# Altium project PULPino_Board.PrjPcb
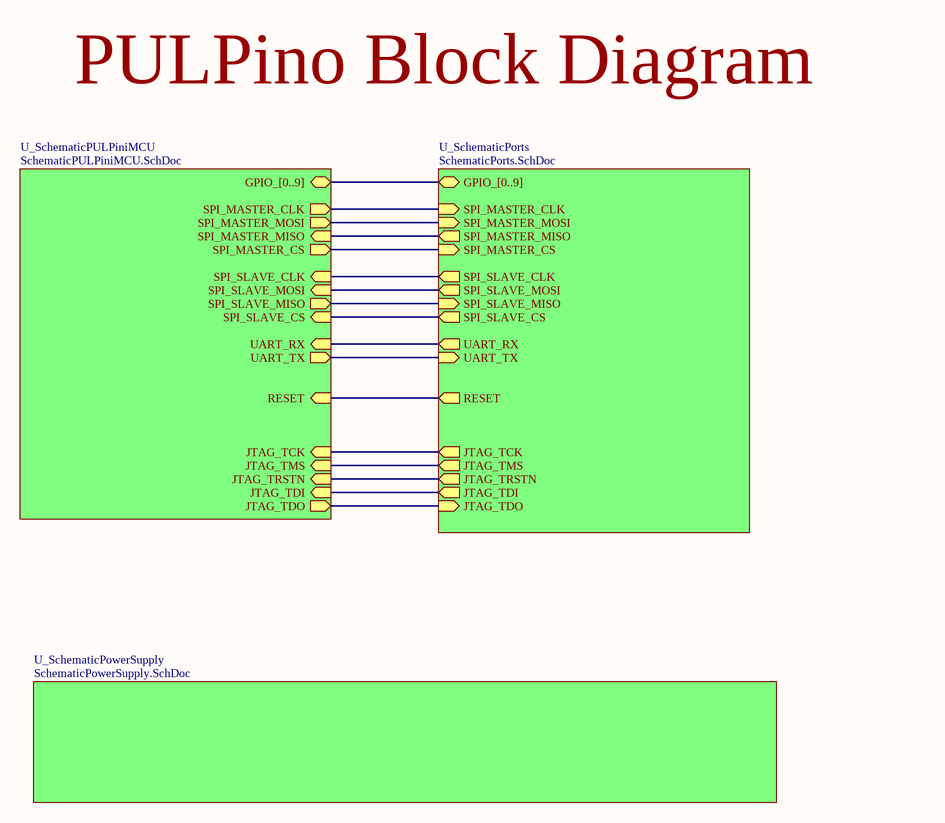
[diagram p0: TopSheet.SchDoc]
4 sheets, 36 parts. Net scope: hierarchical (ports join the sheet entries above them; power ports are global).
Board file: PULpino.PcbDoc
Sheets:
  TopSheet.SchDoc
    U_SchematicPorts = SchematicPorts.SchDoc
    U_SchematicPowerSupply = SchematicPowerSupply.SchDoc
    U_SchematicPULPiniMCU = SchematicPULPiniMCU.SchDoc

## Sheet TopSheet.SchDoc
size A4; DocumentNumber: 1; SheetNumber: 1; SheetTotal: 4

### Sub-sheets
U_SchematicPorts = SchematicPorts.SchDoc: JTAG_TCK (out), JTAG_TRSTN (out), JTAG_TMS (out), JTAG_TDI (out), JTAG_TDO (in), UART_TX (in), UART_RX (out), SPI_MASTER_CS (in), SPI_MASTER_CLK (in), SPI_MASTER_MISO (out), SPI_MASTER_MOSI (in), SPI_SLAVE_CLK (out), SPI_SLAVE_CS (out), SPI_SLAVE_MISO (in), SPI_SLAVE_MOSI (out), GPIO_[0..9] (bidir), RESET (out)
U_SchematicPowerSupply = SchematicPowerSupply.SchDoc: no entries
U_SchematicPULPiniMCU = SchematicPULPiniMCU.SchDoc: SPI_SLAVE_CLK (in), SPI_SLAVE_CS (in), SPI_SLAVE_MISO (out), SPI_SLAVE_MOSI (in), SPI_MASTER_CS (out), SPI_MASTER_CLK (out), SPI_MASTER_MISO (in), SPI_MASTER_MOSI (out), UART_TX (out), UART_RX (in), JTAG_TCK (in), JTAG_TRSTN (in), JTAG_TMS (in), JTAG_TDI (in), JTAG_TDO (out), GPIO_[0..9] (bidir), RESET (in)

### Nets
JTAG_TCK: sheet U_SchematicPorts/JTAG_TCK, sheet U_SchematicPULPiniMCU/JTAG_TCK
JTAG_TDI: sheet U_SchematicPorts/JTAG_TDI, sheet U_SchematicPULPiniMCU/JTAG_TDI
JTAG_TDO: sheet U_SchematicPorts/JTAG_TDO, sheet U_SchematicPULPiniMCU/JTAG_TDO
JTAG_TMS: sheet U_SchematicPorts/JTAG_TMS, sheet U_SchematicPULPiniMCU/JTAG_TMS
JTAG_TRSTN: sheet U_SchematicPorts/JTAG_TRSTN, sheet U_SchematicPULPiniMCU/JTAG_TRSTN
RESET: sheet U_SchematicPorts/RESET, sheet U_SchematicPULPiniMCU/RESET
SPI_MASTER_CLK: sheet U_SchematicPorts/SPI_MASTER_CLK, sheet U_SchematicPULPiniMCU/SPI_MASTER_CLK
SPI_MASTER_CS: sheet U_SchematicPorts/SPI_MASTER_CS, sheet U_SchematicPULPiniMCU/SPI_MASTER_CS
SPI_MASTER_MISO: sheet U_SchematicPorts/SPI_MASTER_MISO, sheet U_SchematicPULPiniMCU/SPI_MASTER_MISO
SPI_MASTER_MOSI: sheet U_SchematicPorts/SPI_MASTER_MOSI, sheet U_SchematicPULPiniMCU/SPI_MASTER_MOSI
SPI_SLAVE_CLK: sheet U_SchematicPorts/SPI_SLAVE_CLK, sheet U_SchematicPULPiniMCU/SPI_SLAVE_CLK
SPI_SLAVE_CS: sheet U_SchematicPorts/SPI_SLAVE_CS, sheet U_SchematicPULPiniMCU/SPI_SLAVE_CS
SPI_SLAVE_MISO: sheet U_SchematicPorts/SPI_SLAVE_MISO, sheet U_SchematicPULPiniMCU/SPI_SLAVE_MISO
SPI_SLAVE_MOSI: sheet U_SchematicPorts/SPI_SLAVE_MOSI, sheet U_SchematicPULPiniMCU/SPI_SLAVE_MOSI
UART_RX: sheet U_SchematicPorts/UART_RX, sheet U_SchematicPULPiniMCU/UART_RX
UART_TX: sheet U_SchematicPorts/UART_TX, sheet U_SchematicPULPiniMCU/UART_TX

### Buses and harness runs
bus sheet U_SchematicPorts/GPIO_[0..9] = sheet U_SchematicPULPiniMCU/GPIO_[0..9]

### Notes on the sheet
- PULPino Block Diagram

## Sheet SchematicPorts.SchDoc
size A4; DocumentNumber: 3; SheetNumber: 3; SheetTotal: 4
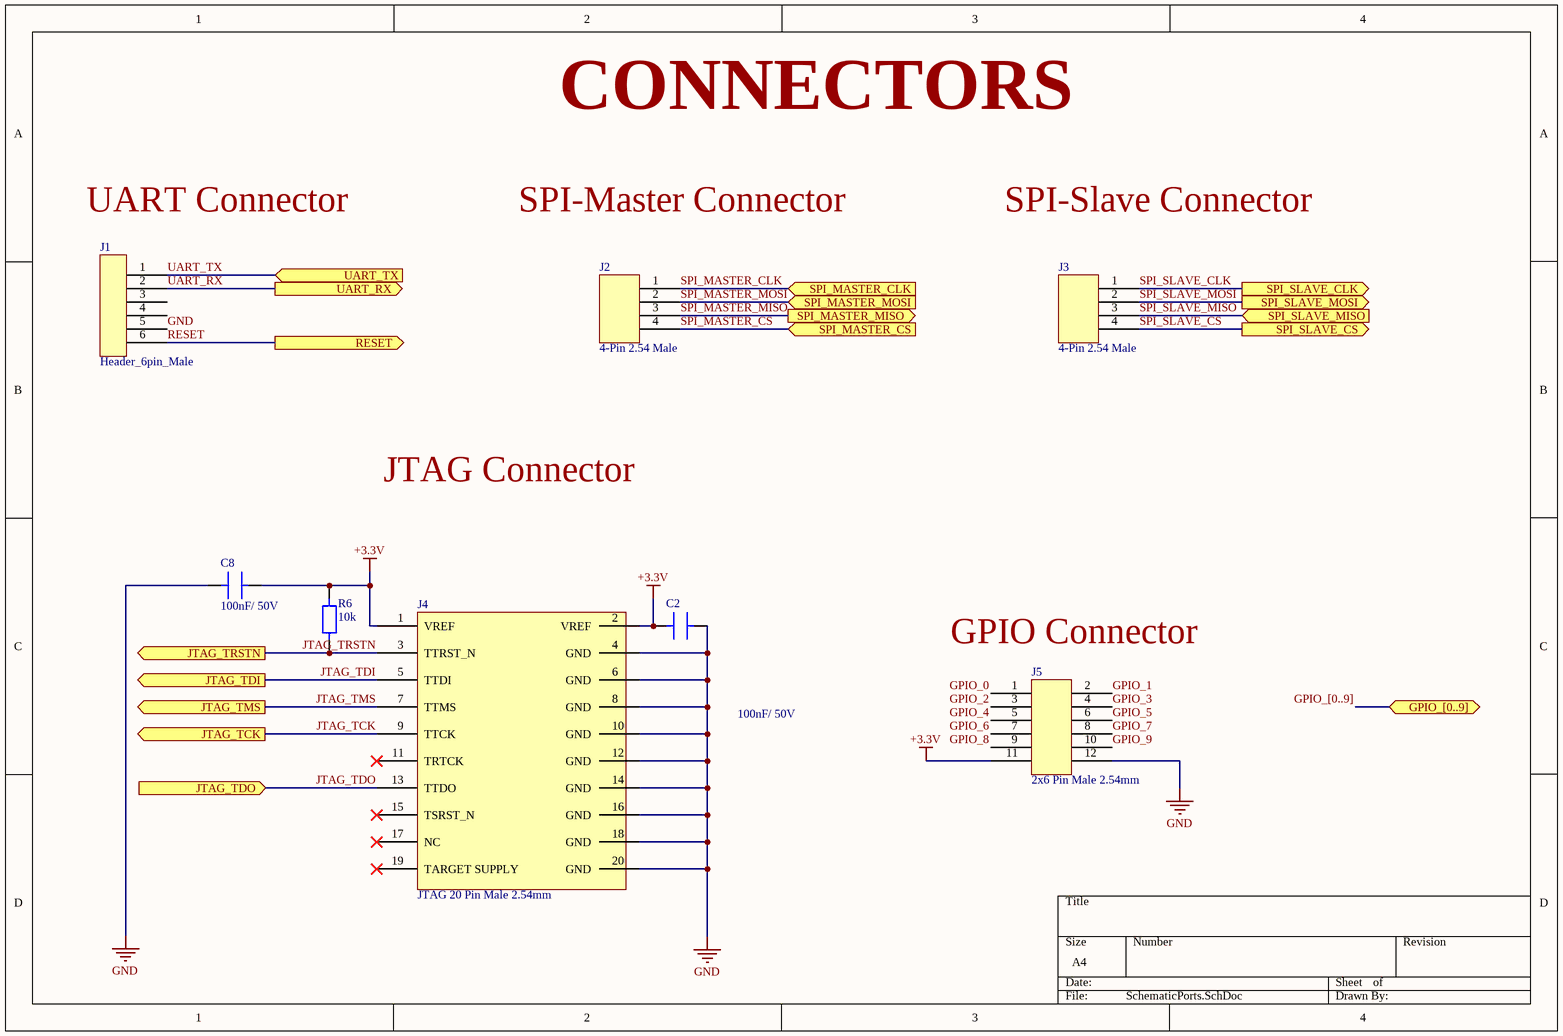
[diagram p1: SchematicPorts.SchDoc]

### Parts
C2  100nF/ 50V  [C0603]
C8  100nF/ 50V  [C0603]
J1  Header_6pin_Male  [Header_6pin_male]
J2  4-Pin 2.54 Male  [DIP4 4X1 Pitch 2.54mm]
J3  4-Pin 2.54 Male  [DIP4 4X1 Pitch 2.54mm]
J4  JTAG 20 Pin Male 2.54mm  [JTAG 20-Pin]
J5  2x6 Pin Male 2.54mm  [DIP12 2X6 Pitch 2.54mm]
R6  10k  [R0603]

### Ports
GPIO_[0..9] (bidir), JTAG_TCK (out), JTAG_TDI (out), JTAG_TDO (in), JTAG_TMS (out), JTAG_TRSTN (out), RESET (out), SPI_MASTER_CLK (in), SPI_MASTER_CS (in), SPI_MASTER_MISO (out), SPI_MASTER_MOSI (in), SPI_SLAVE_CLK (out), SPI_SLAVE_CS (out), SPI_SLAVE_MISO (in), SPI_SLAVE_MOSI (out), UART_RX (out), UART_TX (in)

### Nets
+3.3V: C2.2 C8.1 J4.1(VREF) J4.2(VREF) J5.11 R6.2
GND: C2.1 C8.2 J1.5 J4.4(GND) J4.6(GND) J4.8(GND) J4.10(GND) J4.12(GND) J4.14(GND) J4.16(GND) J4.18(GND) J4.20(GND) J5.12
GPIO_0: J5.1
GPIO_1: J5.2
GPIO_2: J5.3
GPIO_3: J5.4
GPIO_4: J5.5
GPIO_5: J5.6
GPIO_6: J5.7
GPIO_7: J5.8
GPIO_8: J5.9
GPIO_9: J5.10
JTAG_TCK: J4.9(TTCK) ; port JTAG_TCK
JTAG_TDI: J4.5(TTDI) ; port JTAG_TDI
JTAG_TDO: J4.13(TTDO) ; port JTAG_TDO
JTAG_TMS: J4.7(TTMS) ; port JTAG_TMS
JTAG_TRSTN: J4.3(TTRST_N) R6.1 ; port JTAG_TRSTN
RESET: J1.6 ; port RESET
SPI_MASTER_CLK: J2.1 ; port SPI_MASTER_CLK
SPI_MASTER_CS: J2.4 ; port SPI_MASTER_CS
SPI_MASTER_MISO: J2.3 ; port SPI_MASTER_MISO
SPI_MASTER_MOSI: J2.2 ; port SPI_MASTER_MOSI
SPI_SLAVE_CLK: J3.1 ; port SPI_SLAVE_CLK
SPI_SLAVE_CS: J3.4 ; port SPI_SLAVE_CS
SPI_SLAVE_MISO: J3.3 ; port SPI_SLAVE_MISO
SPI_SLAVE_MOSI: J3.2 ; port SPI_SLAVE_MOSI
UART_RX: J1.2 ; port UART_RX
UART_TX: J1.1 ; port UART_TX

Not connected (* = marked no-connect by the designer): J1 3 4; J4 11(TRTCK)* 15(TSRST_N)* 17(NC)* 19(TARGET_SUPPLY)*

### Buses and harness runs
bus GPIO_[0..9] = port GPIO_[0..9]

### Notes on the sheet
- CONNECTORS
- UART Connector
- SPI-Master Connector
- SPI-Slave Connector
- JTAG Connector
- (near J5) GPIO Connector

### Library data of the parts
C2 C8 = C 100nF/ 50V: C0603/C0805
J2 J3 = Molex 90120-0124 1x4 Pin Male 2.54mm
J4 = JTAG 20-Pin 2.54 ARM USB-Tiny H
J5 = Molex 90131-1086 2x6 PIn Header_1
R6 = RES_10k: 0805

## Sheet SchematicPowerSupply.SchDoc
size A4; DocumentNumber: 4; SheetNumber: 4; SheetTotal: 4
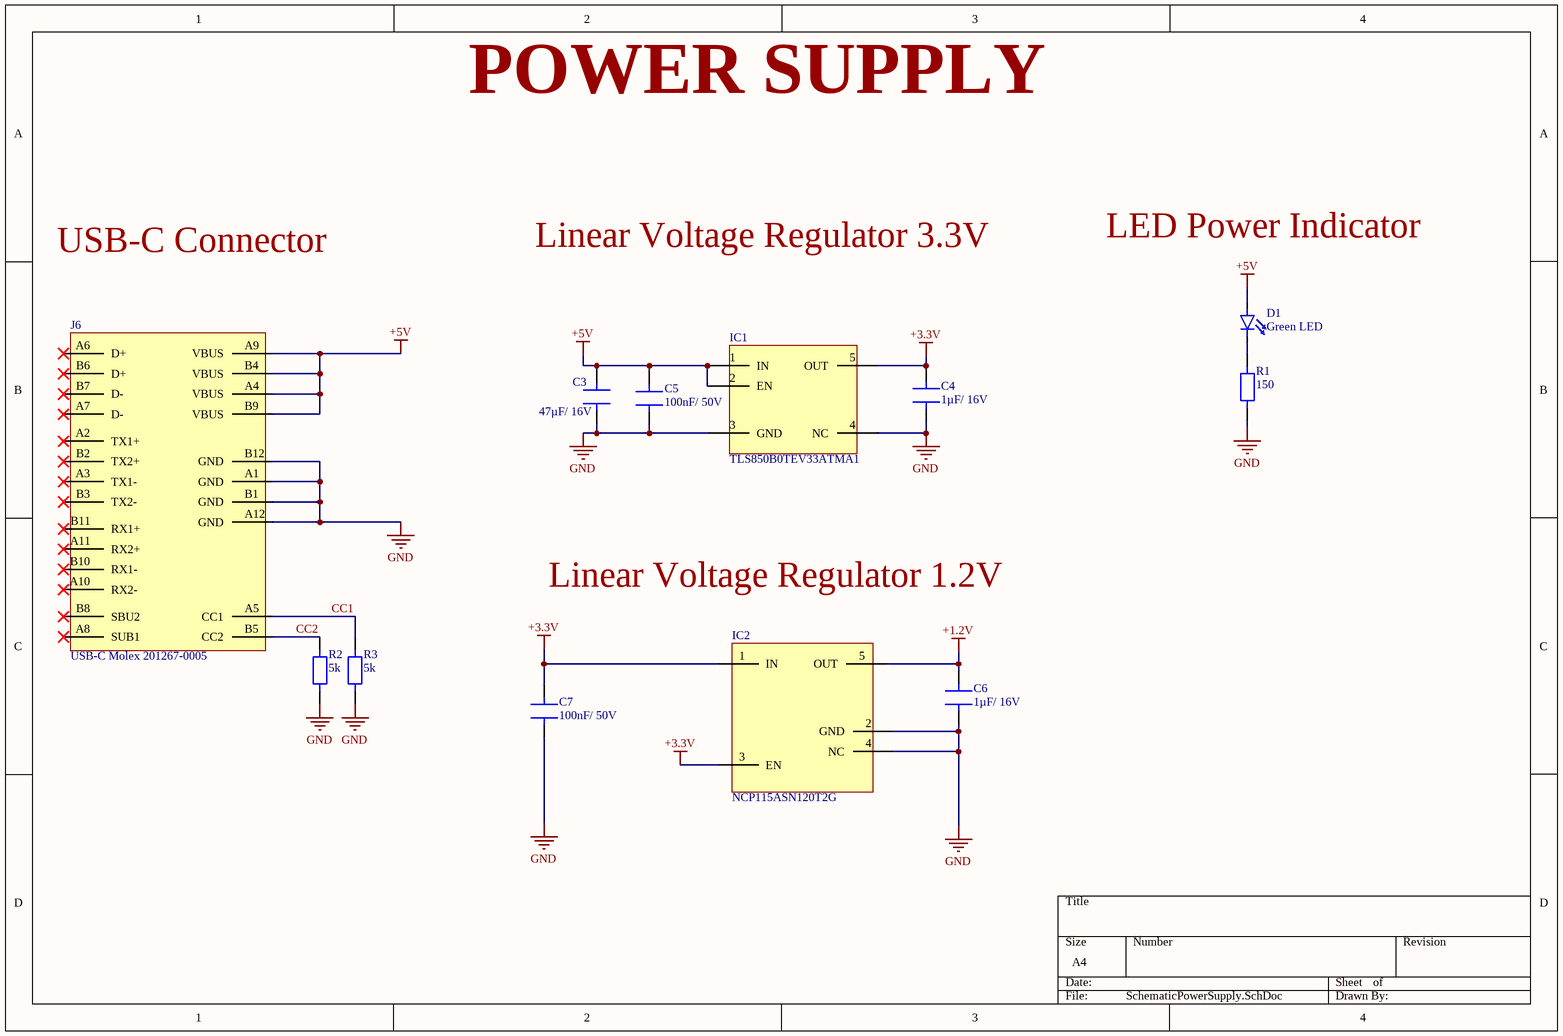
[diagram p2: SchematicPowerSupply.SchDoc]

### Parts
C3  47µF/ 16V  [C1210]
C4  1µF/ 16V  [C0603]
C5  100nF/ 50V  [C0603]
C6  1µF/ 16V  [C0603]
C7  100nF/ 50V  [C0603]
D1  Green LED  [LED_0805]
IC1  TLS850B0TEV33ATMA1  [TO-252-5]
IC2  NCP115ASN120T2G  [TSOP-5]
J6  USB-C Molex 201267-0005  [USB-C Molex 2012670005]
R1  150  [R0603]
R2  5k  [R0603]
R3  5k  [R0603]

### Nets
+1.2V: C6.2 IC2.5(OUT)
+3.3V: C4.2 C7.2 IC1.5(OUT) IC2.1(IN) IC2.3(EN)
+5V: C3.2 C5.2 D1.1 IC1.1(IN) IC1.2(EN) J6.A4(VBUS) J6.A9(VBUS) J6.B4(VBUS) J6.B9(VBUS)
GND: C3.1 C4.1 C5.1 C6.1 C7.1 IC1.3(GND) IC1.4(NC) IC2.2(GND) IC2.4(NC) J6.A1(GND) J6.A12(GND) J6.B1(GND) J6.B12(GND) R1.1 R2.1 R3.1
CC1: J6.A5(CC1) R3.2
CC2: J6.B5(CC2) R2.2
NetD1_2: D1.2 R1.2

Not connected (* = marked no-connect by the designer): J6 A2(TX1+)* A3(TX1-)* A6(D+)* A7(D-)* A8(SUB1)* A10(RX2-)* A11(RX2+)* B2(TX2+)* B3(TX2-)* B6(D+)* B7(D-)* B8(SBU2)* B10(RX1-)* B11(RX1+)*

### Notes on the sheet
- POWER SUPPLY
- LED Power Indicator
- USB-C Connector
- Linear Voltage Regulator 3.3V
- Linear Voltage Regulator 1.2V

### Library data of the parts
C3 = C 47µF/ 16V: C1210
C4 C6 = C 1µF/ 16V: C0603/C0805
C5 C7 = C 100nF/ 50V: C0603/C0805
D1 = LED 0805: Status LED
IC1 = TLS850B0TEV33ATMA1: Input 3-40V, Output 3.3V
IC2 = NCP115ASN120T2G: Input 1.7V-5.5V, Ouput 1.2V
R1 = RES_150: 0603/0805
R2 R3 = RES_5k: 0603/0805

## Sheet SchematicPULPiniMCU.SchDoc
size A4; DocumentNumber: 2; SheetNumber: 2; SheetTotal: 4
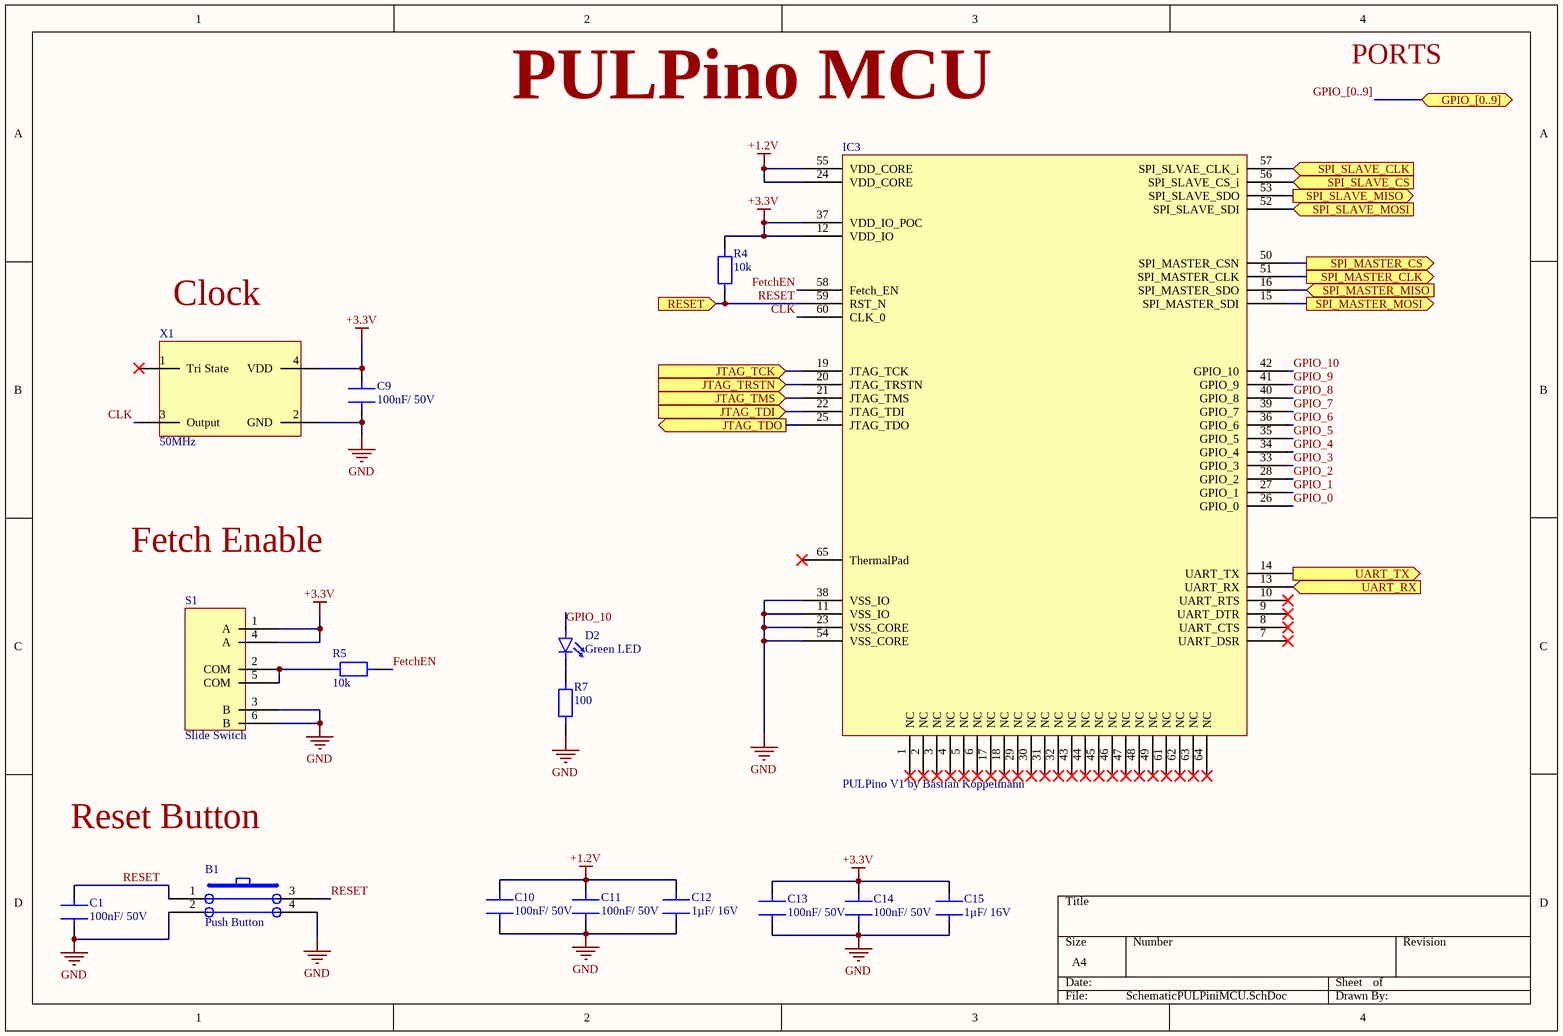
[diagram p3: SchematicPULPiniMCU.SchDoc]

### Parts
B1  Push Button  [PUSH Switch]
C1  100nF/ 50V  [C0603]
C9  100nF/ 50V  [C0603]
C10  100nF/ 50V  [C0603]
C11  100nF/ 50V  [C0603]
C12  1µF/ 16V  [C0603]
C13  100nF/ 50V  [C0603]
C14  100nF/ 50V  [C0603]
C15  1µF/ 16V  [C0603]
D2  Green LED  [LED_0805]
IC3  PULPino V1 by Bastian Koppelmann  [MQFN 64-Lead 9mm P=0.5mm]
R4  10k  [R0603]
R5  10k  [R0603]
R7  100  [R0603]
S1  Slide Switch  [Slide Switch WE 452403012014]
X1  50MHz  [QFN 2520 SiT1602 Oscillators 2.5x2.0mm]

### Ports
GPIO_[0..9] (bidir), JTAG_TCK (in), JTAG_TDI (in), JTAG_TDO (out), JTAG_TMS (in), JTAG_TRSTN (in), RESET (in), SPI_MASTER_CLK (out), SPI_MASTER_CS (out), SPI_MASTER_MISO (in), SPI_MASTER_MOSI (out), SPI_SLAVE_CLK (in), SPI_SLAVE_CS (in), SPI_SLAVE_MISO (out), SPI_SLAVE_MOSI (in), UART_RX (in), UART_TX (out)

### Nets
+1.2V: C10.2 C11.2 C12.2 IC3.24(VDD_CORE) IC3.55(VDD_CORE)
+3.3V: C9.1 C13.2 C14.2 C15.2 IC3.12(VDD_IO) IC3.37(VDD_IO_POC) R4.2 S1.1(A) S1.4(A) X1.4(VDD)
GND: B1.2 B1.4 C1.2 C9.2 C10.1 C11.1 C12.1 C13.1 C14.1 C15.1 IC3.11(VSS_IO) IC3.23(VSS_CORE) IC3.38(VSS_IO) IC3.54(VSS_CORE) R7.1 S1.3(B) S1.6(B) X1.2(GND)
CLK: IC3.60(CLK_0) X1.3(Output)
FetchEN: IC3.58(Fetch_EN) R5.2
GPIO_0: IC3.26(GPIO_0)
GPIO_1: IC3.27(GPIO_1)
GPIO_2: IC3.28(GPIO_2)
GPIO_3: IC3.33(GPIO_3)
GPIO_4: IC3.34(GPIO_4)
GPIO_5: IC3.35(GPIO_5)
GPIO_6: IC3.36(GPIO_6)
GPIO_7: IC3.39(GPIO_7)
GPIO_8: IC3.40(GPIO_8)
GPIO_9: IC3.41(GPIO_9)
GPIO_10: D2.1 IC3.42(GPIO_10)
JTAG_TCK: IC3.19(JTAG_TCK) ; port JTAG_TCK
JTAG_TDI: IC3.22(JTAG_TDI) ; port JTAG_TDI
JTAG_TDO: IC3.25(JTAG_TDO) ; port JTAG_TDO
JTAG_TMS: IC3.21(JTAG_TMS) ; port JTAG_TMS
JTAG_TRSTN: IC3.20(JTAG_TRSTN) ; port JTAG_TRSTN
RESET: B1.1 B1.3 C1.1 IC3.59(RST_N) R4.1 ; port RESET
SPI_MASTER_CLK: IC3.51(SPI_MASTER_CLK) ; port SPI_MASTER_CLK
SPI_MASTER_CS: IC3.50(SPI_MASTER_CSN) ; port SPI_MASTER_CS
SPI_MASTER_MISO: IC3.16(SPI_MASTER_SDO) ; port SPI_MASTER_MISO
SPI_MASTER_MOSI: IC3.15(SPI_MASTER_SDI) ; port SPI_MASTER_MOSI
SPI_SLAVE_CLK: IC3.57(SPI_SLVAE_CLK_i) ; port SPI_SLAVE_CLK
SPI_SLAVE_CS: IC3.56(SPI_SLAVE_CS_i) ; port SPI_SLAVE_CS
SPI_SLAVE_MISO: IC3.53(SPI_SLAVE_SDO) ; port SPI_SLAVE_MISO
SPI_SLAVE_MOSI: IC3.52(SPI_SLAVE_SDI) ; port SPI_SLAVE_MOSI
UART_RX: IC3.13(UART_RX) ; port UART_RX
UART_TX: IC3.14(UART_TX) ; port UART_TX
NetD2_2: D2.2 R7.2
NetR5_1: R5.1 S1.2(COM) S1.5(COM)

Not connected (* = marked no-connect by the designer): IC3 1(NC)* 2(NC)* 3(NC)* 4(NC)* 5(NC)* 6(NC)* 7(UART_DSR)* 8(UART_CTS)* 9(UART_DTR)* 10(UART_RTS)* 17(NC)* 18(NC)* 29(NC)* 30(NC)* 31(NC)* 32(NC)* 43(NC)* 44(NC)* 45(NC)* 46(NC)* 47(NC)* 48(NC)* 49(NC)* 61(NC)* 62(NC)* 63(NC)* 64(NC)* 65(ThermalPad)*; X1 1(Tri_State)*

### Buses and harness runs
bus GPIO_[0..9] = port GPIO_[0..9]

### Notes on the sheet
- (near IC3) PULPino MCU
- PORTS
- Clock
- Fetch Enable
- Reset Button

### Library data of the parts
B1 = Push Button PTS647SM50SMTR2LFS: PTS647SM50SMTR2LFS
C1 C9-C11 C13 C14 = C 100nF/ 50V: C0603/C0805
C12 C15 = C 1µF/ 16V: C0603/C0805
D2 = LED 0805: Status LED
IC3 = MCU PULPino V1 QFN64: Version 1 PULPino by Bastian Koppelmann
R4 R5 = RES_10k: 0805
R7 = RES_100: 0603/0805
S1 = Slide Switch WE 452403012014: Slide Switch, WE 452403012014
X1 = SiT1602BC-11-33N-50.000000: Oscillator 50MHz. Pin 1 NC

## Nets that join several sheets
+1.2V: SchematicPowerSupply (C6.2 IC2.5), SchematicPULPiniMCU (5 pins)
+3.3V: SchematicPorts (6 pins), SchematicPowerSupply (5 pins), SchematicPULPiniMCU (10 pins)
GND: SchematicPorts (13 pins), SchematicPowerSupply (16 pins), SchematicPULPiniMCU (18 pins)
GPIO_0: SchematicPorts (J5.1), SchematicPULPiniMCU (IC3.26)
GPIO_1: SchematicPorts (J5.2), SchematicPULPiniMCU (IC3.27)
GPIO_2: SchematicPorts (J5.3), SchematicPULPiniMCU (IC3.28)
GPIO_3: SchematicPorts (J5.4), SchematicPULPiniMCU (IC3.33)
GPIO_4: SchematicPorts (J5.5), SchematicPULPiniMCU (IC3.34)
GPIO_5: SchematicPorts (J5.6), SchematicPULPiniMCU (IC3.35)
GPIO_6: SchematicPorts (J5.7), SchematicPULPiniMCU (IC3.36)
GPIO_7: SchematicPorts (J5.8), SchematicPULPiniMCU (IC3.39)
GPIO_8: SchematicPorts (J5.9), SchematicPULPiniMCU (IC3.40)
GPIO_9: SchematicPorts (J5.10), SchematicPULPiniMCU (IC3.41)
JTAG_TCK: SchematicPorts (J4.9), SchematicPULPiniMCU (IC3.19)
JTAG_TDI: SchematicPorts (J4.5), SchematicPULPiniMCU (IC3.22)
JTAG_TDO: SchematicPorts (J4.13), SchematicPULPiniMCU (IC3.25)
JTAG_TMS: SchematicPorts (J4.7), SchematicPULPiniMCU (IC3.21)
JTAG_TRSTN: SchematicPorts (J4.3 R6.1), SchematicPULPiniMCU (IC3.20)
RESET: SchematicPorts (J1.6), SchematicPULPiniMCU (5 pins)
SPI_MASTER_CLK: SchematicPorts (J2.1), SchematicPULPiniMCU (IC3.51)
SPI_MASTER_CS: SchematicPorts (J2.4), SchematicPULPiniMCU (IC3.50)
SPI_MASTER_MISO: SchematicPorts (J2.3), SchematicPULPiniMCU (IC3.16)
SPI_MASTER_MOSI: SchematicPorts (J2.2), SchematicPULPiniMCU (IC3.15)
SPI_SLAVE_CLK: SchematicPorts (J3.1), SchematicPULPiniMCU (IC3.57)
SPI_SLAVE_CS: SchematicPorts (J3.4), SchematicPULPiniMCU (IC3.56)
SPI_SLAVE_MISO: SchematicPorts (J3.3), SchematicPULPiniMCU (IC3.53)
SPI_SLAVE_MOSI: SchematicPorts (J3.2), SchematicPULPiniMCU (IC3.52)
UART_RX: SchematicPorts (J1.2), SchematicPULPiniMCU (IC3.13)
UART_TX: SchematicPorts (J1.1), SchematicPULPiniMCU (IC3.14)